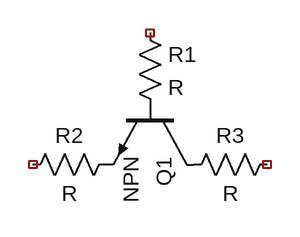
[diagram p0: schematic Draft8.asc]
Draft8.asc, the LTspice schematic file:
Version 4
SHEET 1 880 680
SYMBOL npn 224 -320 R90
SYMATTR InstName Q1
SYMBOL res 160 -416 R0
SYMATTR InstName R1
SYMBOL res 144 -272 R90
WINDOW 0 0 56 VBottom 2
WINDOW 3 32 56 VTop 2
SYMATTR InstName R2
SYMBOL res 320 -272 R90
WINDOW 0 0 56 VBottom 2
WINDOW 3 32 56 VTop 2
SYMATTR InstName R3

The netlist it stands for:
* Draft8.asc
Q1 P001 P002 P003 0 NPN
R1 NC_01 P002 R
R2 P003 NC_02 R
R3 NC_03 P001 R
.model NPN NPN
.model PNP PNP
.lib standard.bjt
.backanno
.end